# Altium schematic sheet Main Control Board.SchDoc
size A; SheetNumber: 2; SheetTotal: 2
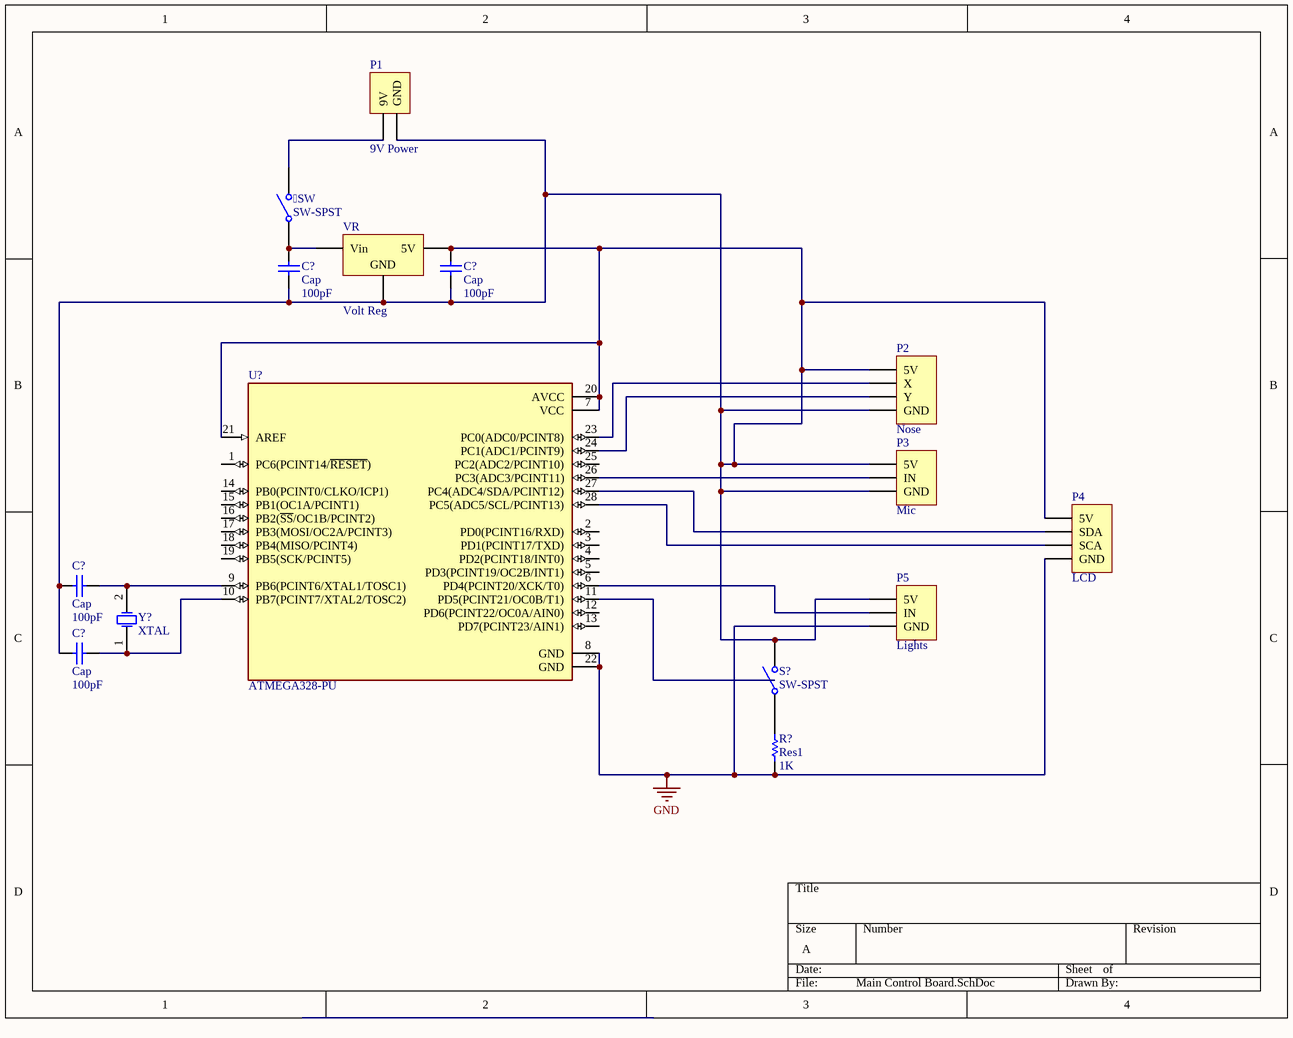
[diagram p0: Main Control Board.SchDoc]

## Parts
(Parts that share a designator on the sheet are numbered #1, #2 ... from top to bottom, then left to right.)
SW  SW-SPST  [SPST-2]
C?#1  Cap  value 100pF  [RAD-0.3]
C?#2  Cap  value 100pF  [RAD-0.3]
C?#3  Cap  value 100pF  [RAD-0.3]
C?#4  Cap  value 100pF  [RAD-0.3]
P1  9V Power  [HDR1X2]
P2  Nose  [HDR1X4]
P3  Mic  [HDR1X3]
P4  LCD  [HDR1X4]
P5  Lights  [HDR1X3]
R?  Res1  value 1K  [AXIAL-0.3]
S?  SW-SPST  [SPST-2]
U?  ATMEGA328-PU  [DIP787W46P254L3467H508Q28]
VR  Volt Reg  [D2PAK_N]
Y?  XTAL  [R38]

## Nets
GND: P4.4(GND) P5.3(GND) R?.1 U?.8(GND) U?.22(GND)
NetSW_1: SW.1(COMMON) C?#1.1 VR.1(Vin)
NetSW_2: SW.2(NO) P1.1(9V)
NetC?#1_2: C?#1.2 C?#2.1 C?#2.2 C?#3.1 C?#4.1 P1.2(GND) P2.1(5V) P2.4(GND) P3.1(5V) P3.3(GND) P4.1(5V) P5.1(5V) S?.2(NO) U?.7(VCC) U?.20(AVCC) U?.21(AREF) VR.2(GND) VR.3(5V)
NetC?#3_2: C?#3.2 U?.9(PB6(PCINT6/XTAL1/TOSC1)) Y?.2(OSC2)
NetC?#4_2: C?#4.2 U?.10(PB7(PCINT7/XTAL2/TOSC2)) Y?.1(OSC1)
NetP2_2: P2.2(X) U?.23(PC0(ADC0/PCINT8))
NetP2_3: P2.3(Y) U?.24(PC1(ADC1/PCINT9))
NetP3_2: P3.2(IN) U?.26(PC3(ADC3/PCINT11))
NetP4_2: P4.2(SDA) U?.27(PC4(ADC4/SDA/PCINT12))
NetP4_3: P4.3(SCA) U?.28(PC5(ADC5/SCL/PCINT13))
NetP5_2: P5.2(IN) U?.6(PD4(PCINT20/XCK/T0))
NetR?_2: R?.2 S?.1(COMMON)

Not connected (* = marked no-connect by the designer): U? 1(PC6(PCINT14/~{RESET})) 2(PD0(PCINT16/RXD)) 3(PD1(PCINT17/TXD)) 4(PD2(PCINT18/INT0)) 5(PD3(PCINT19/OC2B/INT1)) 11(PD5(PCINT21/OC0B/T1)) 12(PD6(PCINT22/OC0A/AIN0)) 13(PD7(PCINT23/AIN1)) 14(PB0(PCINT0/CLKO/ICP1)) 15(PB1(OC1A/PCINT1)) 16(PB2(~{SS}/OC1B/PCINT2)) 17(PB3(MOSI/OC2A/PCINT3)) 18(PB4(MISO/PCINT4)) 19(PB5(SCK/PCINT5)) 25(PC2(ADC2/PCINT10))

## Library data of the parts
SW S? = SW-SPST: Single-Pole, Single-Throw Switch; Published: 24-Mar-1999; LatestRevisionDate: 17-Jul-2002; LatestRevisionNote: Re-released for DXP Platform.; PackageReference: SPST-2; Publisher: Altium Limited; PackageDescription: Switch; 2 Leads
C?#1-C?#4 = Cap: Capacitor; Published: 8-Jun-2000; LatestRevisionDate: 17-Jul-2002; LatestRevisionNote: Re-released for DXP Platform.; PackageReference: RAD-0.3; Publisher: Altium Limited; PackageDescription: Radial Cap, Thru-Hole; 2 Leads; 0.3 in Pin Spacing
P1 = Header 2: Header, 2-Pin; LatestRevisionDate: 17-Jul-2002; LatestRevisionNote: Re-released for DXP Platform.; Publisher: Altium Limited
P2 P4 = Header 4: Header, 4-Pin; LatestRevisionDate: 17-Jul-2002; LatestRevisionNote: Re-released for DXP Platform.; Publisher: Altium Limited
P3 P5 = Header 3: Header, 3-Pin; LatestRevisionDate: 17-Jul-2002; LatestRevisionNote: Re-released for DXP Platform.; Publisher: Altium Limited
R? = Res1: Resistor; Published: 8-Jun-2000; LatestRevisionDate: 17-Jul-2002; LatestRevisionNote: Re-released for DXP Platform.; PackageReference: AXIAL-0.3; Publisher: Altium Limited; PackageDescription: Axial Device, Thru-Hole; 2 Leads; 0.3 in Pin Spacing
U? = ATMEGA328-PU: AVR AVRÂ® ATmega Microcontroller IC 8-Bit 20MHz 32KB (16K x 16) FLASH 28-PDIP; MF: Microchip Technology; Value: *; Package: DIP-28 Microchip Technology; Availability: In Stock; Check_prices: https://www.snapeda.com/parts/ATMEGA328-PU/Microchip/view-part/?ref=eda; SnapEDA_Link: https://www.snapeda.com/parts/ATMEGA328-PU/Microchip/view-part/?ref=snap; Purchase-URL: https://pricing.snapeda.com/search/part/ATMEGA328-PU/?ref=eda; MP: ATMEGA328-PU; Price: None
VR = Volt Reg: Voltage Regulator; Published: 24-Mar-1999; LatestRevisionDate: 29-May-2009; LatestRevisionNote: IPC-7351 Footprint Added.; PackageReference: D2PAK; Publisher: Altium Limited; PackageDescription: 3-Pin Transistor Outline Package 2.54 mm Pitch, 15.1 mm Lead Span
Y? = XTAL: Crystal Oscillator; Published: 8-Jun-2000; LatestRevisionDate: 17-Jul-2002; LatestRevisionNote: Re-released for DXP Platform.; PackageReference: R38; Publisher: Altium Limited; PackageDescription: Crystal, Thru-Hole; 2 Leads; Body 3.1 x 8.2 mm (Dia.xH)